# Altium schematic sheet E17-04-HV-CONNECTORS.SchDoc
size A; DocumentNumber: 16; SheetNumber: 16; SheetTotal: 18
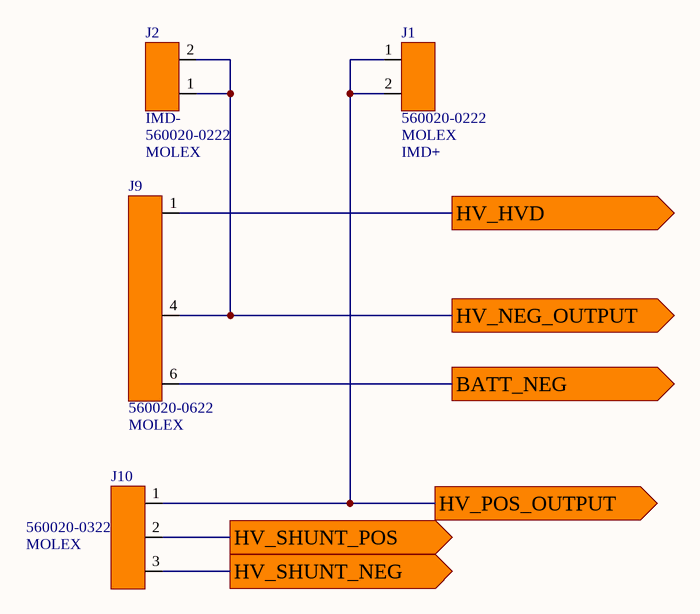
[diagram p0: E17-04-HV-CONNECTORS.SchDoc]

## Parts
J1  IMD+  MANUFACTURER: MOLEX  [MOLEX_DURACLIK_2 RED VERT]
J2  IMD-  MANUFACTURER: MOLEX  [MOLEX_DURACLIK_2 RED VERT]
J9  MPN: 560020-0622  MANUFACTURER: MOLEX  [MOLEX_DURACLIK_6 RED VERT HV]  (hidden comment: HV BUS)
J10  MANUFACTURER: MOLEX  [MOLEX_DURACLIK_3 RED - VERT]  (hidden comment: SHUNT)

## Ports
BATT_NEG (out), HV_HVD (out), HV_NEG_OUTPUT (out), HV_POS_OUTPUT (out), HV_SHUNT_NEG (out), HV_SHUNT_POS (out)

## Nets
BATT_NEG: J9.6 ; port BATT_NEG
HV_HVD: J9.1 ; port HV_HVD
HV_NEG_OUTPUT: J2.1 J2.2 J9.4 ; port HV_NEG_OUTPUT
HV_POS_OUTPUT: J1.1 J1.2 J10.1 ; port HV_POS_OUTPUT
HV_SHUNT_NEG: J10.3 ; port HV_SHUNT_NEG
HV_SHUNT_POS: J10.2 ; port HV_SHUNT_POS

## Library data of the parts
J1 J2 = 560020-0222: MOLEX DURACLIK 2-PIN VERT RED; POSITIONS: 2; PLATING: Tin (Sn); CURRENT: 3; VOLTAGE: 125; UL: 94V-0; Digikey_PN: Not in production; COLOR: RED; SERIES: Duraclik; ORIENTATOIN: VERT; MPN: 560020-0222
J9 = 560020-0622_HV: MOLEX DURACLIK 6-PIN VERT RED; POSITIONS: 6; UL: 94V-0; VOLTAGE: 250; CURRENT: 3; PLATING: Tin (Sn); Digikey_PN: Not in production; COLOR: RED; SERIES: Duraclik; ORIENTATOIN: VERT
J10 = 560020-0322: MOLEX DURACLIK 3-PIN VERT RED; POSITIONS: 3; PLATING: Tin (Sn); VOLTAGE: 125; UL: 94V-0; Digikey_PN: Not in production; COLOR: RED; SERIES: Duraclik; ORIENTATOIN: VERT; CURRENT: 3; MPN: 560020-0322